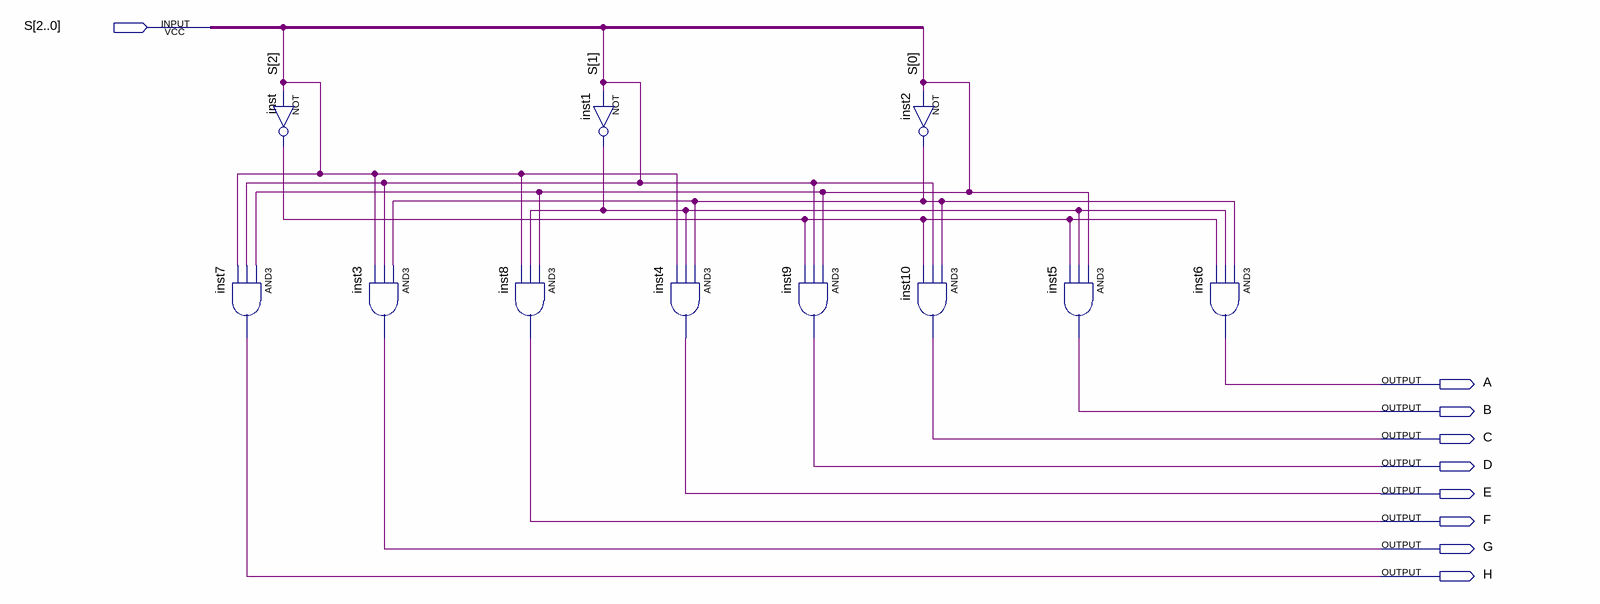
[diagram p0: schematic sheet]
// Quartus schematic selector_8way.bdf as structural Verilog: 11 symbols, 9 pins
module selector_8way (
  input  [2:0] S,
  output A,
  output B,
  output C,
  output D,
  output E,
  output F,
  output G,
  output H
);

  wire inst1_out, inst2_out, inst_out;

  and inst7 (H, S[0], S[1], S[2]);
  not inst (inst_out, S[2]);
  and inst3 (G, inst2_out, S[1], S[2]);
  and inst8 (F, S[0], inst1_out, S[2]);
  not inst1 (inst1_out, S[1]);
  and inst4 (E, inst2_out, inst1_out, S[2]);
  and inst9 (D, S[0], S[1], inst_out);
  not inst2 (inst2_out, S[0]);
  and inst10 (C, inst2_out, S[1], inst_out);
  and inst5 (B, S[0], inst1_out, inst_out);
  and inst6 (A, inst2_out, inst1_out, inst_out);
endmodule
